# Altium schematic sheet SCH,Itsy_Bitsy_SAW.SchDoc
size B; SheetNumber: 1; SheetTotal: 1
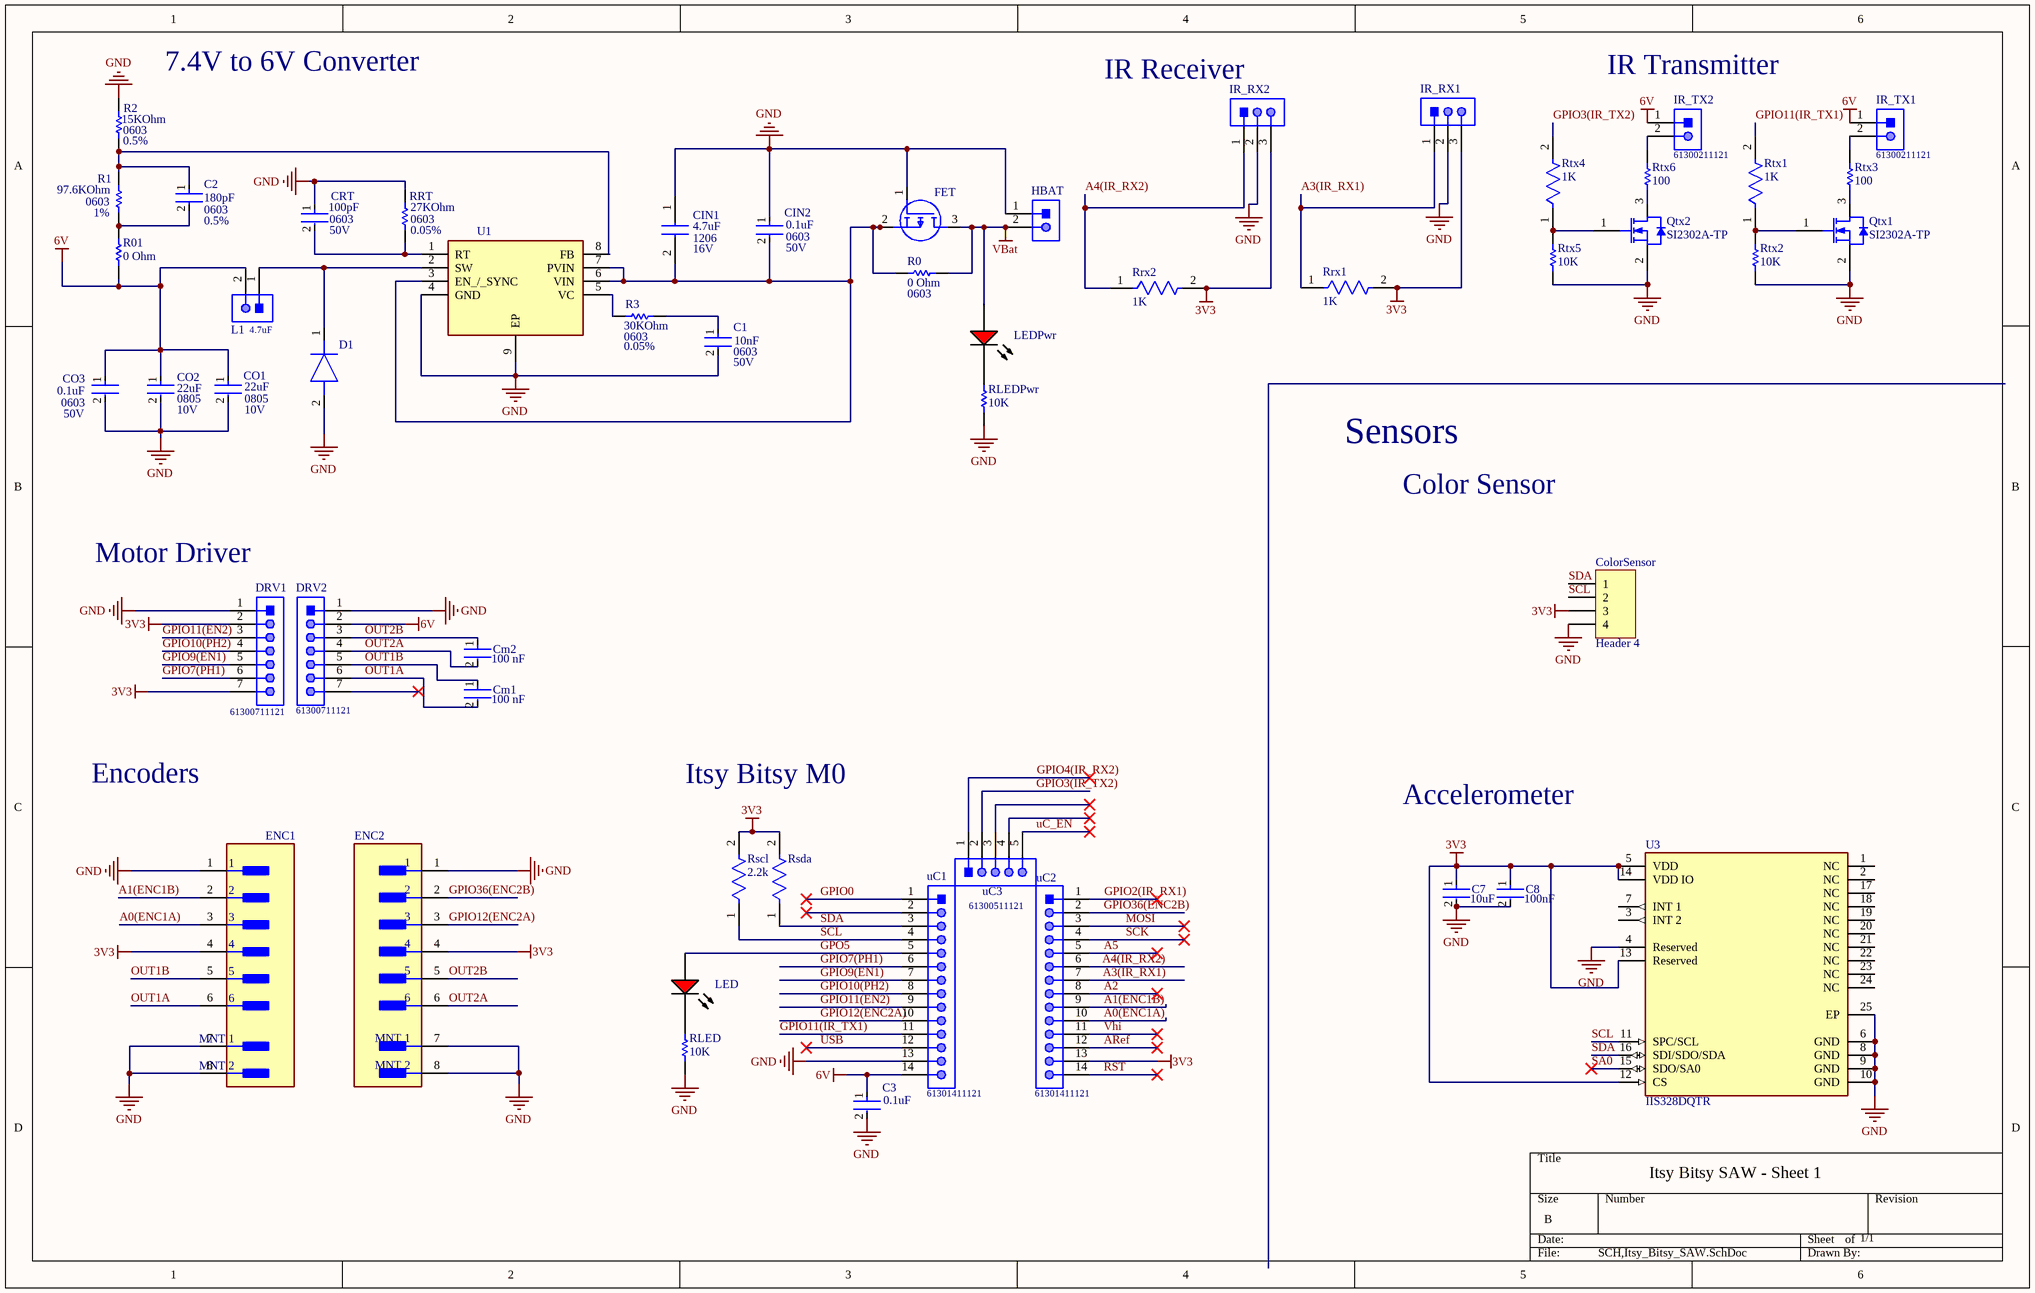
[diagram p0: SCH,Itsy_Bitsy_SAW.SchDoc]

## Parts
C1  10nF  [FP-GRM188-0_15-IPC_B]
C2  180pF  [FP-GRM188-0_15-IPC_B]
C3  0.1uF  [FP-CL10-IPC_A]
C7  Capacitance: 10uF  [FP-GRM188-0_1-e0_2_0_55-IPC_A]  (hidden comment: GRM188R60J106ME47D)
C8  Capacitance: 100nF  [FP-CGA3E-0_3-0_1-IPC_A]  (hidden comment: CGA3E2X7R1H104K080AA)
CIN1  4.7uF  [C1206]
CIN2  0.1uF  [FP-CL10-IPC_A]
Cm1  value 100 nF  [FP-CC0603-DA-MFG]  (hidden comment: CC0603KRX7R7BB104)
Cm2  value 100 nF  [FP-CC0603-DA-MFG]  (hidden comment: CC0603KRX7R7BB104)
CO1  22uF  [FP-GRM21B-0_2-e0_2_0_7-IPC_B]
CO2  22uF  [FP-GRM21B-0_2-e0_2_0_7-IPC_B]
CO3  0.1uF  [FP-CL10-IPC_A]
ColorSensor  Header 4  [HDR1X4]
CRT  100pF  [FP-GCM188-0_1-IPC_B]
D1  SD2114S040S8R0  [DIOC5236X120N]  (value not drawn)
DRV1  61300711121  [61300711121]
DRV2  61300711121  [61300711121]
ENC1  BM06B-NSHSS-TBT (LF)(SN)  [FP-BM06B-NSHSS-TBT_LF_S-MFG]  (value not drawn)
ENC2  BM06B-NSHSS-TBT (LF)(SN)  [FP-BM06B-NSHSS-TBT_LF_S-MFG]  (value not drawn)
FET  RQ5A025ZPTL  [SOT95P280X100-3N]  (value not drawn)
HBAT  61300211121  [61300211121]  (value not drawn)
IR_RX1  61300311121  [61300311121]  (value not drawn)
IR_RX2  61300311121  [61300311121]  (value not drawn)
IR_TX1  61300211121  [61300211121]
IR_TX2  61300211121  [61300211121]
L1  4.7uF  [61300211121]
LED  TLMS1100-GS08  [VISH-TLMX1100_V]  (value not drawn)
LEDPwr  TLMS1100-GS08  [VISH-TLMX1100_V]  (value not drawn)
Qtx1  SI2302A-TP  [VISH-TO-236-3_A_L]
Qtx2  SI2302A-TP  [VISH-TO-236-3_A_L]
R0  0 Ohm  [RESC1608X55X25ML10T15]
R1  97.6KOhm  [RESC1609X55X30LL15T15]
R01  0 Ohm  [RESC1608X55X25ML10T15]
R2  15KOhm  [RESC1609X55X30LL15T15]
R3  30KOhm  [RESC1608X55X30NL20T20]
RLED  10K  [RESC1609X50X30NL8T20]
RLEDPwr  10K  [RESC1609X50X30NL8T20]
RRT  27KOhm  [RESC1608X55X30NL20T20]
Rrx1  1K  [FP-CRCW0603-e3-MFG]
Rrx2  1K  [FP-CRCW0603-e3-MFG]
Rscl  2.2k  [FP-RMCF0603-IPC_A]
Rsda  2.2k  [FP-RMCF0603-IPC_A]  (value not drawn)
Rtx1  1K  [FP-CR0603-IPC_A]
Rtx2  10K  [RESC1609X50X30NL8T20]
Rtx3  100  [RESC1608X55X30LL15T15]
Rtx4  1K  [FP-CR0603-IPC_A]
Rtx5  10K  [RESC1609X50X30NL8T20]
Rtx6  100  [RESC1608X55X30LL15T15]
U1  BD90640EFJ-CE2  [SOIC127P600X100-9N]  (value not drawn)
U3  IIS328DQTR  [FP-IIS328DQTR-MFG]
uC1  61301411121  [61301411121]
uC2  61301411121  [61301411121]
uC3  61300511121  [61300511121]

## Nets
3V3: C7.1 C8.1 ColorSensor.3 DRV1.2 DRV1.7 ENC1.4 ENC2.4 IR_RX1.3 IR_RX2.3 Rrx1.2 Rrx2.2 Rscl.2 Rsda.2 U3.5(VDD) U3.12(CS) U3.13(Reserved) U3.14(VDD_IO) uC2.13
6V: C3.1 CO1.1 CO2.1 CO3.1 DRV2.2 IR_TX1.1 IR_TX2.1 L1.2 R01.1 uC1.14
GND: C1.2 C3.2 C7.2 C8.2 CIN1.1 CIN2.1 CO1.2 CO2.2 CO3.2 ColorSensor.4 CRT.1 D1.2(A) DRV1.1 DRV2.1 ENC1.1 ENC1.7(MNT_1) ENC1.8(MNT_2) ENC2.1 ENC2.7(MNT_1) ENC2.8(MNT_2) FET.1(G) HBAT.1 IR_RX1.2 IR_RX2.2 Qtx1.2(S) Qtx2.2(S) R2.1 RLED.1 RLEDPwr.1 RRT.2 Rtx2.1 Rtx5.1 U1.4(GND) U1.9(EP) U3.4(Reserved) U3.6(GND) U3.8(GND) U3.9(GND) U3.10(GND) U3.25(EP) uC1.13
VBat: FET.3(D) HBAT.2 LEDPwr.1(A) R0.2
A0(ENC1A): ENC1.3 uC2.10
A1(ENC1B): ENC1.2 uC2.9
A2: uC2.8
A3(IR_RX1): IR_RX1.1 Rrx1.1 uC2.7
A4(IR_RX2): IR_RX2.1 Rrx2.1 uC2.6
A5: uC2.5
ARef: uC2.12
GPIO0: uC1.1
GPIO2(IR_RX1): uC2.1
GPIO3(IR_TX2): Rtx4.2 uC3.2
GPIO4(IR_RX2): uC3.1
GPIO7(PH1): DRV1.6 uC1.6
GPIO9(EN1): DRV1.5 uC1.7
GPIO10(PH2): DRV1.4 uC1.8
GPIO11(EN2): DRV1.3 uC1.9
GPIO11(IR_TX1): Rtx1.2 uC1.11
GPIO12(ENC2A): ENC2.3 uC1.10
GPIO36(ENC2B): ENC2.2 uC2.2
GPO5: LED.1(A) uC1.5
MOSI: uC2.3
OUT1A: Cm1.2 DRV2.6 ENC1.6
OUT1B: Cm1.1 DRV2.5 ENC1.5
OUT2A: Cm2.2 DRV2.4 ENC2.6
OUT2B: Cm2.1 DRV2.3 ENC2.5
RST: uC2.14
SA0: U3.15(SDO/SA0)
SCK: uC2.4
SCL: ColorSensor.2 Rscl.1 U3.11(SPC/SCL) uC1.4
SDA: ColorSensor.1 Rsda.1 U3.16(SDI/SDO/SDA) uC1.3
uC_EN: uC3.5
USB: uC1.12
Vhi: uC2.11
NetC1_1: C1.1 R3.2
NetC2_1: C2.1 R1.2 R2.2 U1.8(FB)
NetC2_2: C2.2 R1.1 R01.2
NetCIN1_2: CIN1.2 CIN2.2 FET.2(S) R0.1 U1.3(EN_/_SYNC) U1.6(VIN) U1.7(PVIN)
NetCRT_2: CRT.2 RRT.1 U1.1(RT)
NetD1_1: D1.1(K) L1.1 U1.2(SW)
NetIR_TX1_2: IR_TX1.2 Rtx3.2
NetIR_TX2_2: IR_TX2.2 Rtx6.2
NetLED_2: LED.2(K) RLED.2
NetLEDPwr_2: LEDPwr.2(K) RLEDPwr.2
NetQtx1_1: Qtx1.1(G) Rtx1.1 Rtx2.2
NetQtx1_3: Qtx1.3(D) Rtx3.1
NetQtx2_1: Qtx2.1(G) Rtx4.1 Rtx5.2
NetQtx2_3: Qtx2.3(D) Rtx6.1
NetR3_1: R3.1 U1.5(VC)

Not connected (* = marked no-connect by the designer): DRV2 7*; U3 1(NC) 2(NC) 3(INT_2) 7(INT_1) 17(NC) 18(NC) 19(NC) 20(NC) 21(NC) 22(NC) 23(NC) 24(NC); uC1 2*; uC3 3* 4*

## Notes on the sheet
- 7.4V to 6V Converter
- (near IR_RX2) IR Receiver
- (near IR_TX2) IR Transmitter
- (near R2) 0603
- (near R2) 0.5%
- (near R1) 0603
- 1%
- (near C2) 0603
- (near C2) 0.5%
- (near CRT) 0603
- (near CRT) 50V
- (near RRT) 0603
- (near RRT) 0.05%
- (near CIN1) 1206
- (near CIN1) 16V
- (near CIN2) 0603
- (near CIN2) 50V
- (near R0) 0603
- (near R3) 0603
- (near R3) 0.05%
- (near C1) 0603
- (near C1) 50V
- (near CO3) 0603
- (near CO3) 50V
- 0805
- (near CO2) 10V
- (near CO1) 0805
- (near CO1) 10V
- Sensors
- Color Sensor
- (near DRV1) Motor Driver
- Encoders
- Itsy Bitsy M0
- Accelerometer
- Itsy Bitsy SAW - Sheet 1
- 1/1

## Library data of the parts
C1 C2 = CMP-06035-062935-1: CAP CER 4.7UF 16V X5R 0603; Tolerance: 10%; Material: Ceramic; Thickness: 0.037inch; RoHS Compliant: Yes; REACH SVHC: No SVHC; Case Code (Metric): 1608; Width: 0.8mm; Lead Free: Lead Free; Packaging: Tape and Reel; Capacitance: 4.7uF; Depth: 0.8mm; Package Quantity: 4000; Mount: Surface Mount; Voltage Rating: 16V; Termination: SMD/SMT; Height: 0.8mm; Voltage Rating (DC): 16V; Weight: 0.000222oz; Dielectric: X5R; Case Code (Imperial): 0603; Series: GRM; Min Operating Temperature: -55°C; Max Operating Temperature: 85°C; Case/Package: 0603; Length: 1.6mm
C3 CIN2 CO3 = CMP-13271-002353-1: Cap Ceramic 100nF 50V X7R ±10% Pad SMD 0603 +125°C T/R; Ratings: AEC-Q200; Capacitance: 100nF; Features: Soft Termination; Max Operating Temperature: 125°C; Mount: Surface Mount; Case/Package: 0603; Width: 0.031inch; Voltage Rating: 50V; Case Code (Metric): 1608; Case Code (Imperial): 0603; Tolerance: 10%; Min Operating Temperature: -55°C; Thickness: 0.035inch; Lead Free: Lead Free; Packaging: Tape and Reel; Length: 0.063inch
C7 = CMP-2006-02792-2: Chip Multilayer Ceramic Capacitors for General Purpose, 0603, 10uF, X5R, 15%, 20%, 6.3V; Packaging: Tape and Reel; Voltage Rating (DC): 6.3V; Width: 0.031inch; Termination: SMD/SMT; Dielectric: X5R; Package Quantity: 4000; Voltage Rating: 6.3V; Case/Package: 0603; Min Operating Temperature: -55°C; Voltage: 6.3V; Length: 1.6mm; Thickness: 0.035inch; Lead Free: Lead Free; Depth: 0.8mm; Case Code (Imperial): 0603; Max Operating Temperature: 85°C; Material: Ceramic; Height: 0.8mm; Tolerance: 20%; Mount: Surface Mount; REACH SVHC: No SVHC; Radiation Hardening: No; Case Code (Metric): 1608
C8 = CMP-2000-07546-2: Cap Ceramic 100nF 50V X7R 10% Pad SMD 0603 +125°C Automotive T/R; Weight: 7.1E-05oz; Composition: Ceramic; Max Operating Temperature: 125°C; Termination: SMD/SMT; Dielectric: X7R; Length: 1.6mm; Package Quantity: 1; REACH SVHC: No SVHC; Lead Free: Lead Free; Case Code (Metric): 1608; Min Operating Temperature: -55°C; Packaging: Tape and Reel; Tolerance: 10%; Voltage Rating: 50V; Case Code (Imperial): 0603; Case/Package: 0603; Voltage Rating (DC): 50V; Depth: 0.8mm; Radiation Hardening: No; Ratings: AEC-Q200; Mount: Surface Mount; Voltage: 50V; Thickness: 0.035inch; Width: 0.8mm; Height: 0.8mm
CIN1 = C1206J475K4RACAUTO: Capacitor; Manufacturer_Name: KEMET; Datasheet Link: https://content.kemet.com/datasheets/KEM_C1012_X7R_OPENMODE_SMD.pdf; Manufacturer_Part_Number: C1206J475K4RACAUTO
Cm1 Cm2 = CMP-2000-05002-2: CAP CER 0.1UF 16V X7R 0603; Manufacturer: YAGEO; Tolerance: 0.1; Temperature Coefficient: 15%; Voltage Rating: 16 V; Package: CC0603-DA; ComponentLink2Description: Datasheet; Octopart: https://octopart.com/cc0603krx7r7bb104-yageo-192941; Temperature Range High: +125°C; Digikey Description: CAP CER 0.1UF 16V X7R 0603; Voltage: 16 V; Device Class L2: Capacitors; Height: 0.9mm; Temperature: -55°C to +125°C; Manufacturer Part Number: CC0603KRX7R7BB104; Device Class L1: Passive Components; Device Class L3: Ceramic Capacitors; ComponentLink2URL: http://www.yageo.com/documents/recent/UPY-GPHC_X7R_6.3V-to-50V_18.pdf; Footprint Url: http://www.yageo.com/exep/pages/download/literatures/UPY-C_GEN_24.pdf; RoHS: TRUE; Temperature Range Low: -55°C; Temperature Characteristic: X7R; Lead Free: Yes; Capacitance: 100 nF; Category: Cap; Mouser Description: Multilayer Ceramic Capacitor, CC Series, 0.1 - F, - 10%, X7R, 16 V, 0603 [1608 Metric]; Material: Ceramic; Automotive: No
CO1 CO2 = CMP-06035-023072-1: Chip Multilayer Ceramic Capacitors for General Purpose, 0805, 22uF, X7R, 15%, 20%, 10V
ColorSensor = Header 4: Header, 4-Pin; LatestRevisionDate: 17-Jul-2002; LatestRevisionNote: Re-released for DXP Platform.; Publisher: Altium Limited
CRT = CMP-2006-02301-2: CAP CER 100PF 50V C0G/NP0 0603; Temperature Coefficient: 30ppm/°C; Tolerance: 5%; Dielectric: C0G; Package Quantity: 1; Construction: Flat; Max Operating Temperature: 125°C; Termination: SMD/SMT; Voltage: 50V; Radiation Hardening: No; Packaging: Tape and Reel; Case Code (Metric): 1608; RoHS Compliant: Yes; Case/Package: 0603; Voltage Rating (DC): 50V; Series: GCM; Width: 0.031inch; Ratings: AEC-Q200; Capacitance: 100pF; REACH SVHC: No SVHC; Length: 1.6mm; Case Code (Imperial): 0603; Height: 0.8mm; Min Operating Temperature: -55°C; Mount: Surface Mount; Thickness: 0.035inch; Voltage Rating: 50V; Lead Free: Lead Free; Depth: 0.8mm
D1 = SD2114S040S8R0: Diode; Manufacturer_Name: AVX; Datasheet Link: http://datasheets.avx.com/schottky.pdf; Height: 1.2mm; Manufacturer_Part_Number: SD2114S040S8R0; Mouser Part Number: 581-SD2114S040S8R0; Mouser Price/Stock: https://www.mouser.co.uk/ProductDetail/AVX/SD2114S040S8R0?qs=jCA%252BPfw4LHZSB6eM%2Fh4uoQ%3D%3D; Arrow Part Number: SD2114S040S8R0; Arrow Price/Stock: https://www.arrow.com/en/products/sd2114s040s8r0/avx?region=nac
DRV1 DRV2 = CMP-1502-01074-1: THT Vertical Pin Header WR-PHD, Pitch 2.54 mm, Single Row, 7 pins; Manufacturer: Wurth Elektronik; Pin Number: 7; Gender: Male; Working Voltage: 250VAC; Contact Resistance: 20mOhm; Rated Current: 3A; Pitch: 2.54mm; Withstanding Voltage: 500VAC; Row Number: Single; Packaging: Bag; Orientation: Vertical; Manufacturer URL: http://www.we-online.de; Datasheet URL: https://katalog.we-online.de/em/datasheet/6130xx11121.pdf; Part Number: 61300711121; Publisher: WurthElektronik; Operating Temperature: -40to105degC; Mounting Technology: THT; Package Reference: 61300711121
ENC1 ENC2 = CMP-17439-000400-1: CONN HEADER SMD 6POS 1MM; Max Voltage Rating (AC): 50V; Connector Type: Outer Shroud Contact; Pitch: 0.039inch; Number of Positions: 6; Contact Resistance: 50mR; Max Current Rating: 1A; Housing Material: Polyamide; Depth: 4.95mm; Min Operating Temperature: -25°C; Fastening Type: Latch; Contact Material: Copper Alloy; Orientation: Straight; Length: 8mm; Contact Plating: Tin; Series: NSH; Mount: Surface Mount; Packaging: Cut Tape; Max Operating Temperature: 85°C; Contact Type: Outer Shroud Contact; Housing Color: Natural; Termination: Solder; Color: Natural; Number of Rows: 1
FET = RQ5A025ZPTL: MOSFET (P-Channel); Manufacturer_Name: ROHM Semiconductor; Datasheet Link: https://componentsearchengine.com/Datasheets/2/RQ5A025ZPTL.pdf; Height: 1mm; Manufacturer_Part_Number: RQ5A025ZPTL; Mouser Part Number: 755-RQ5A025ZPTL; Mouser Price/Stock: https://www.mouser.co.uk/ProductDetail/ROHM-Semiconductor/RQ5A025ZPTL?qs=HXFqYaX1Q2wDTma0Ho%252BA3A%3D%3D
HBAT IR_TX1 IR_TX2 L1 = CMP-1712-00002-4: THT Vertical Pin Header WR-PHD, Pitch 2.54 mm, Single Row, 2 pins; Manufacturer: Wurth Elektronik; Rated Current: 3A; Gender: Male; Withstanding Voltage: 500VAC; Working Voltage: 250VAC; Pitch: 2.54mm; Contact Resistance: 20mOhm; Pin Number: 2; Mounting Technology: THT; Orientation: Vertical; Operating Temperature: -40to105degC; Packaging: Bag; Publisher: WurthElektronik; Datasheet URL: https://katalog.we-online.de/em/datasheet/6130xx11121.pdf; Manufacturer URL: http://www.we-online.de; Row Number: Single; Package Reference: 61300211121; Part Number: 61300211121
IR_RX1 IR_RX2 = CMP-1502-01062-1: THT Vertical Pin Header WR-PHD, Pitch 2.54 mm, Single Row, 3 pins; Manufacturer: Wurth Elektronik; Withstanding Voltage: 500VAC; Working Voltage: 250VAC; Rated Current: 3A; Pitch: 2.54mm; Pin Number: 3; Gender: Male; Contact Resistance: 20mOhm; Package Reference: 61300311121; Manufacturer URL: http://www.we-online.de; Datasheet URL: https://katalog.we-online.de/em/datasheet/6130xx11121.pdf; Operating Temperature: -40to105degC; Part Number: 61300311121; Orientation: Vertical; Packaging: Bag; Row Number: Single; Mounting Technology: THT; Publisher: WurthElektronik
LED LEDPwr = CMP-1666-00027-1: LED, RED, 2.1 V, -40 to 100 degC, 2-Pin SMD (0603), RoHS, Tape and Reel; Type (Capacitors): C0G; Resistance: 100000000000 Ohm; Capacitance: 12 pF; Voltage Rating: 50 V; Tolerance: 5%; Min Operating Temperature: -55degC; REACH SVHC: No SVHC; ComponentLink2Description: Datasheet; ComponentLink1URL: http://www.vishay.com/; Width: 0.8 mm; Package Quantity: 4000; PackageReference: TLMX1100; ComponentLink2URL: http://www.vishay.com/docs/83173/tlmb1100.pdf; Case/Package: 0603; Case Code (Metric): 1608; Packaging: Tape and Reel; Pins: 2; ComponentLink1Description: Manufacturer URL; Max Operating Temperature: 125degC; Height: 0.8 mm; Length: 1.6 mm; Mount: Surface Mount; PackageDescription: 2-Pin Surface Mount Device, Body 1.6 x 0.8 mm; DatasheetVersion: Rev. 2.7, 03/2016; Case Code (Imperial): 0603; Voltage Rating (DC): 50 V; RoHSCompliant: True; Radiation Hardening: No
Qtx1 Qtx2 = CMP-2000-05565-1: N-Channel MOSFET, 115 mA, 60 V, -55 to 150 degC, 3-Pin SOT23, RoHS, Tape and Reel; Manufacturer: Vishay; Continuous Drain Current Id: 115mA; Threshold Voltage Vgs: 2.1V; Transistor Case Style: TO-236; On Resistance Rds(on): 7.5ohm; Transistor Polarity: NChannel; Power Dissipation Pd: 200mW; No. of Pins: 3; SVHC: NoSVHC(17-Dec-2014); Drain Source Voltage Vds: 60V; Rds(on) Test Voltage Vgs: 10V; Package URL: http://www.vishay.com/docs/71196/71196.pdf; Package Description: 3-Pin Small Outline Transistor, Body 2.92 x 1.3 mm, Pitch 0.95 mm; Datasheet URL: http://www.vishay.com/docs/70226/70226.pdf; Package Reference: TO-236-3; MSL: MSL1-Unlimited; Mounting Technology: SurfaceMount; Operating Temperature Max: 150°C; Datasheet Version: Rev. F, 07/2001; Manufacturer URL: http://www.vishay.com/
R0 R01 = CMP-2100-03667-1: Chip Resistor, 0 Ohm, +/- 5%, 0.1 W, -55 to 155 degC, 0603 (1608 Metric), RoHS, Tape and Reel; Manufacturer: Yageo; Temperature Coefficient: 200ppm/degreesC; Voltage Rating: 50V; Power Rating: 100mW; Resistance: 0mOhm; Width: 0.8mm; Max Operating Temperature: 155degC; Tolerance: 5%; Package Reference: 0603; Height: 0.45mm; Depth: 0.8mm; Package Description: 2-Pin Surface Mount Device, Body 1.6 x 0.8 mm; Termination: SMD/SMT; Package Quantity: 5000; Case/Package: 0603; Case Code (Imperial): 0603; Radiation Hardening: No; Number of Pins: 2; Length: 1.6mm; Lead Free: LeadFree; Voltage Rating (DC): 50V; Military Standard: Not; Datasheet URL: http://www.yageo.com/NewPortal/yageodocoutput?fileName=/pdf/R-Chip/PYu-RC_Group_51_RoHS_L_5.pdf; Manufacturer URL: http://www.yageo.com/; Packaging: TapeandReel; Case Code (Metric): 1608; Min Operating Temperature: -55degC; Composition: ThickFilm; RoHSCompliant: true; Contact Plating: Tin; Datasheet Version: Rev. 5, 10/2016; REACH SVHC: NoSVHC
R1 = CMP-1012-00623-3: CRCW060397K6FKTA, Thick Film Resistors - SMD 1/10watt 97.6Kohms 1%; Manufacturer: Panasonic; Voltage Rating: 75V; Case\/Package: 0603; Power Rating: 100mW; Resistance: 10KOhm; Temperature Coefficient: 100ppm\/degreesC; Number of Pins: 2; Package Reference: 603; Depth: 0.8mm; Mount: SurfaceMount; Package Description: 2-Pin Surface Mount Device, Body 1.6 x 0.85 mm; Datasheet Version: 02/2017; Length: 1.6mm; Lead Free: LeadFree; Height: 0.45mm; Number of Terminations: 2; Max Power Dissipation: 100mW; Min Operating Temperature: -55degC; Datasheet URL: https://industrial.panasonic.com/cdbs/www-data/pdf/RDA0000/AOA0000C304.pdf; Termination: SMD/SMT; Case Code (Metric): 1608; Case Code (Imperial): 0603; Tolerance: 1%; Max Operating Temperature: 155degC; RoHSCompliant: true; Voltage Rating (DC): 75V; Radiation Hardening: No; Packaging: TapeandReel; Composition: ThickFilm; Mounting Technology: SurfaceMount; Manufacturer URL: http://www.panasonic.com/; Width: 0.031inch; REACH SVHC: NoSVHC; Contact Plating: Tin; Military Standard: Not; Package Quantity: 1
R2 = CMP-1012-00623-3: CRCW060315K0DHEAP, Thick Film Resistors - SMD 1/10watt 15Kohms .5% 100ppm Semi-Precisn; Manufacturer: Panasonic; Voltage Rating: 75V; Case\/Package: 0603; Power Rating: 100mW; Resistance: 10KOhm; Tolerance: 1%; Temperature Coefficient: 100ppm\/degreesC; Number of Pins: 2; Package Reference: 603; Depth: 0.8mm; Mount: SurfaceMount; Package Description: 2-Pin Surface Mount Device, Body 1.6 x 0.85 mm; Datasheet Version: 02/2017; Length: 1.6mm; Lead Free: LeadFree; Height: 0.45mm; Number of Terminations: 2; Max Power Dissipation: 100mW; Min Operating Temperature: -55degC; Datasheet URL: https://industrial.panasonic.com/cdbs/www-data/pdf/RDA0000/AOA0000C304.pdf; Termination: SMD/SMT; Case Code (Metric): 1608; Case Code (Imperial): 0603; Max Operating Temperature: 155degC; RoHSCompliant: true; Voltage Rating (DC): 75V; Radiation Hardening: No; Packaging: TapeandReel; Composition: ThickFilm; Mounting Technology: SurfaceMount; Manufacturer URL: http://www.panasonic.com/; Width: 0.031inch; REACH SVHC: NoSVHC; Contact Plating: Tin; Military Standard: Not; Package Quantity: 1
R3 = CMP-2000-00013-1: Part Number: ERA3AEB273V; Manufacturer: Panasonic
RLED RLEDPwr Rtx2 Rtx5 = CMP-1666-00005-4: Chip Resistor, 10 KOhm, +/- 1%, 100 mW, -55 to 155 degC, 0603 (1608 Metric), RoHS, Tape and Reel; Manufacturer: Vishay Semiconductor; Voltage Rating: 75 V; Max Operating Temperature: 155 degC; PackageDescription: 2-Pin Surface Mount Device, Body 1.575 x 0.85 mm; ComponentLink1Description: Manufacturer URL; RoHSCompliant: true; PackageReference: 0603; REACH SVHC: Unknown; Length: 1.55 mm; DatasheetVersion: 06/2012; Packaging: Tape and Reel; Min Operating Temperature: -55 degC; Mounting Technology: Surface Mount; ComponentLink2URL: https://datasheet.ciiva.com/11809/0900766b80d98afc-11809037.pdf; Height: 0.45 mm; ComponentLink2Description: Datasheet; Package Quantity: 5000; ComponentLink1URL: http://www.vishay.com/
RRT = CMP-2000-00013-1: ERA-3ARW273V, Thin Film Resistors - SMD 0603 27Kohm 0.05% 10ppm AEC-Q200; Part Number: ERA3AEB273V; Manufacturer: Panasonic
Rrx1 Rrx2 = CMP-1666-00003-5: RES Thick Film, 1kΩ, 1%, 0.1W, 100ppm/°C, 0603; Max Power Dissipation: 100mW; Voltage Rating: 75V; Resistance: 1kR; Max Operating Temperature: 155°C; Number of Pins: 2; Case Code (Imperial): 0603; Width: 0.033inch; Power Rating: 100mW; Number of Terminations: 2; Package Quantity: 10; Weight: 7.1E-05oz; Tolerance: 1%; Temperature Coefficient: 100ppm/°C; Military Standard: Not; Mount: Surface Mount; Voltage Rating (DC): 75V; Depth: 0.85mm; Composition: Thick Film; Radiation Hardening: No; Termination: SMD/SMT; Length: 1.55mm; Case Code (Metric): 1608; Contact Plating: Tin; Min Operating Temperature: -55°C; Packaging: Tape and Reel; Height: 0.45mm; Lead Free: Lead Free; Case/Package: 0603; Features: Automotive AEC-Q200
Rscl Rsda = CMP-26527-000159-1: 2.2kΩ ±1% 0.1W 0603 Thick Film Chip Resistor AEC-Q200 compliant; Power Rating: 100mW; Temperature Coefficient: 100ppm/°C; Resistance: 2.2kR; RoHS Compliant: Yes; Mount: Surface Mount; Features: Automotive AEC-Q200; Min Operating Temperature: -55°C; Packaging: Tape and Reel; Number of Terminations: 2; Case/Package: 0603; Case Code (Metric): 1608; Width: 0.031inch; Radiation Hardening: No; Tolerance: 1%; Max Power Dissipation: 100mW; Length: 0.061inch; Max Operating Temperature: 155°C; Height: 0.022inch; Lead Free: Lead Free; Series: RMCF; Contact Plating: Tin; Resistor Type: Thick Film; Case Code (Imperial): 0603
Rtx1 Rtx4 = CMP-07231-003313-1: Thick Film Chip Resistors 0603 300Ω 0.1W 5% 200ppm/°C; Voltage Rating: 50V; Resistance: 300R; Max Power Dissipation: 100mW; Package Quantity: 5000; Features: Moisture Resistant; Thickness: 457um; Depth: 0.8mm; Mount: Surface Mount; Temperature Coefficient: 200ppm/°C; Length: 1.6mm; Width: 0.031inch; Military Standard: Not; Packaging: Tape and Reel; Height: 0.022inch; Number of Terminations: 2; Case Code (Imperial): 0603; Case Code (Metric): 1608; Max Operating Temperature: 155°C; Radiation Hardening: No; Min Operating Temperature: -55°C; Composition: Thick Film; Contact Plating: Tin; Case/Package: 0603; Tolerance: 5%; Termination: SMD/SMT; Power Rating: 100mW
Rtx3 Rtx6 = CMP-2000-00179-1: Manufacturer: Panasonic; Part Number: ERJ-3EKF1000V
U1 = BD90640EFJ-CE2: Integrated Circuit; Manufacturer_Name: ROHM Semiconductor; Datasheet Link: https://datasheet.datasheetarchive.com/originals/distributors/DKDS-10/186540.pdf; Height: 1mm; Manufacturer_Part_Number: BD90640EFJ-CE2; Mouser Part Number: 755-BD90640EFJ-CE2; Mouser Price/Stock: https://www.mouser.co.uk/ProductDetail/ROHM-Semiconductor/BD90640EFJ-CE2?qs=zGux8KhMp6Iq6YsLuUD8lw%3D%3D
U3 = CMP-12175-000005-1: ACCELEROMETER 2-8G I2C/SPI 24QFN; Manufacturer: STMicroelectronics; Accel Range: 2/4/8g; Accel Resolution: 16bits; Standoff Height: 0mm; Operating Supply Current: 250uA; Min Supply Voltage: 1.71V; Accel Axis: X+Y and Z; Sensor Output: I2C,SPI; Max Supply Voltage: 3.7V; Device Class L2: Motion Sensors; Temperature: -40°C to +105°C; Digikey Description: ACCELEROMETER 2-8G I2C/SPI 24QFN; Device Class L3: Accelerometers; ComponentLink2URL: https://www.st.com/content/ccc/resource/technical/document/datasheet/24/b9/50/c5/61/ae/4d/58/DM00150114.pdf/files/DM00150114.pdf/jcr:content/translations/en.DM00150114.pdf; Automotive: No; Octopart: https://octopart.com/iis328dqtr-stmicroelectronics-58187312; Device Class L1: Sensors; Package: 0; Ipc Land Pattern Name: QFN50P400X400X180-24; Category: IC; Height: 1.85mm; ComponentLink2Description: Datasheet; Temperature Range High: +105°C; Lead Free: Yes; Manufacturer Part Number: IIS328DQTR; Temperature Range Low: -40°C; RoHS: TRUE
uC1 uC2 = CMP-1502-01091-1: THT Vertical Pin Header WR-PHD, Pitch 2.54 mm, Single Row, 14 pins; Manufacturer: Wurth Elektronik; Pin Number: 14; Working Voltage: 250VAC; Withstanding Voltage: 500VAC; Pitch: 2.54mm; Gender: Male; Contact Resistance: 20mOhm; Rated Current: 3A; Manufacturer URL: http://www.we-online.de; Mounting Technology: THT; Packaging: Bag; Part Number: 61301411121; Orientation: Vertical; Publisher: WurthElektronik; Operating Temperature: -40to105degC; Datasheet URL: https://katalog.we-online.de/em/datasheet/6130xx11121.pdf; Package Reference: 61301411121; Row Number: Single
uC3 = CMP-1502-01068-1: THT Vertical Pin Header WR-PHD, Pitch 2.54 mm, Single Row, 5 pins; Manufacturer: Wurth Elektronik; Pin Number: 5; Contact Resistance: 20mOhm; Working Voltage: 250VAC; Pitch: 2.54mm; Withstanding Voltage: 500VAC; Rated Current: 3A; Gender: Male; Datasheet URL: https://katalog.we-online.de/em/datasheet/6130xx11121.pdf; Orientation: Vertical; Mounting Technology: THT; Row Number: Single; Package Reference: 61300511121; Publisher: WurthElektronik; Part Number: 61300511121; Packaging: Bag; Manufacturer URL: http://www.we-online.de; Operating Temperature: -40to105degC